# Altium schematic sheet MEMORY.SchDoc
size A4
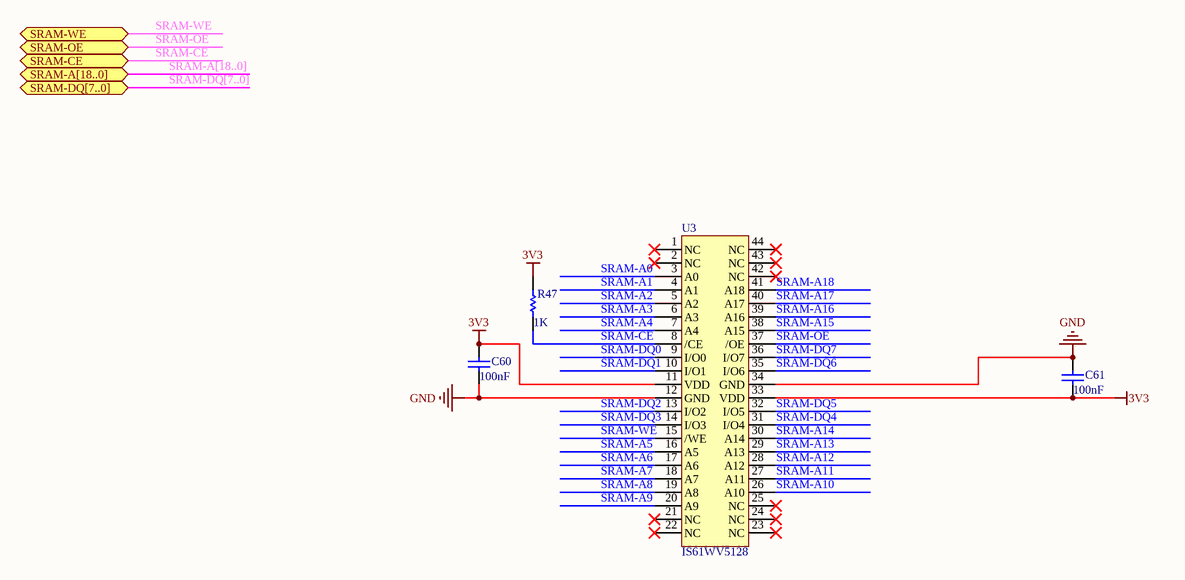
[diagram p0: MEMORY.SchDoc]

## Parts
C60  value 100nF  [1608[0603]]  (hidden comment: Cap)
C61  value 100nF  [1608[0603]]  (hidden comment: Cap)
R47  value 1K  [1608[0603]]  (hidden comment: Res)
U3  IS61WV5128  [SOP127P600-8N IS61WV5128]

## Ports
SRAM-A[18..0], SRAM-CE, SRAM-DQ[7..0], SRAM-OE, SRAM-WE

## Nets
3V3: C60.2 C61.1 R47.2 U3.11(VDD) U3.33(VDD)
GND: C60.1 C61.2 U3.12(GND) U3.34(GND)
SRAM-A0: U3.3(A0)
SRAM-A1: U3.4(A1)
SRAM-A2: U3.5(A2)
SRAM-A3: U3.6(A3)
SRAM-A4: U3.7(A4)
SRAM-A5: U3.16(A5)
SRAM-A6: U3.17(A6)
SRAM-A7: U3.18(A7)
SRAM-A8: U3.19(A8)
SRAM-A9: U3.20(A9)
SRAM-A10: U3.26(A10)
SRAM-A11: U3.27(A11)
SRAM-A12: U3.28(A12)
SRAM-A13: U3.29(A13)
SRAM-A14: U3.30(A14)
SRAM-A15: U3.38(A15)
SRAM-A16: U3.39(A16)
SRAM-A17: U3.40(A17)
SRAM-A18: U3.41(A18)
SRAM-CE: R47.1 U3.8(/CE) ; port SRAM-CE
SRAM-DQ0: U3.9(I/O0)
SRAM-DQ1: U3.10(I/O1)
SRAM-DQ2: U3.13(I/O2)
SRAM-DQ3: U3.14(I/O3)
SRAM-DQ4: U3.31(I/O4)
SRAM-DQ5: U3.32(I/O5)
SRAM-DQ6: U3.35(I/O6)
SRAM-DQ7: U3.36(I/O7)
SRAM-OE: U3.37(/OE) ; port SRAM-OE
SRAM-WE: U3.15(/WE) ; port SRAM-WE

Not connected (* = marked no-connect by the designer): U3 1(NC)* 2(NC)* 21(NC)* 22(NC)* 23(NC)* 24(NC)* 25(NC)* 42(NC)* 43(NC)* 44(NC)*

## Buses and harness runs
bus SRAM-A[18..0] = port SRAM-A[18..0]
bus SRAM-DQ[7..0] = port SRAM-DQ[7..0]

## Library data of the parts
C60 C61 = Cap: 贴片电容; Published: 8-Jun-2000; LatestRevisionDate: 17-Jul-2002; LatestRevisionNote: Re-released for DXP Platform.; PackageReference: RAD-0.3; Publisher: Altium Limited
R47 = Res: 贴片电阻; Published: 8-Jun-2000; LatestRevisionDate: 17-Jul-2002; LatestRevisionNote: Re-released for DXP Platform.; PackageReference: AXIAL-0.3; Publisher: Altium Limited